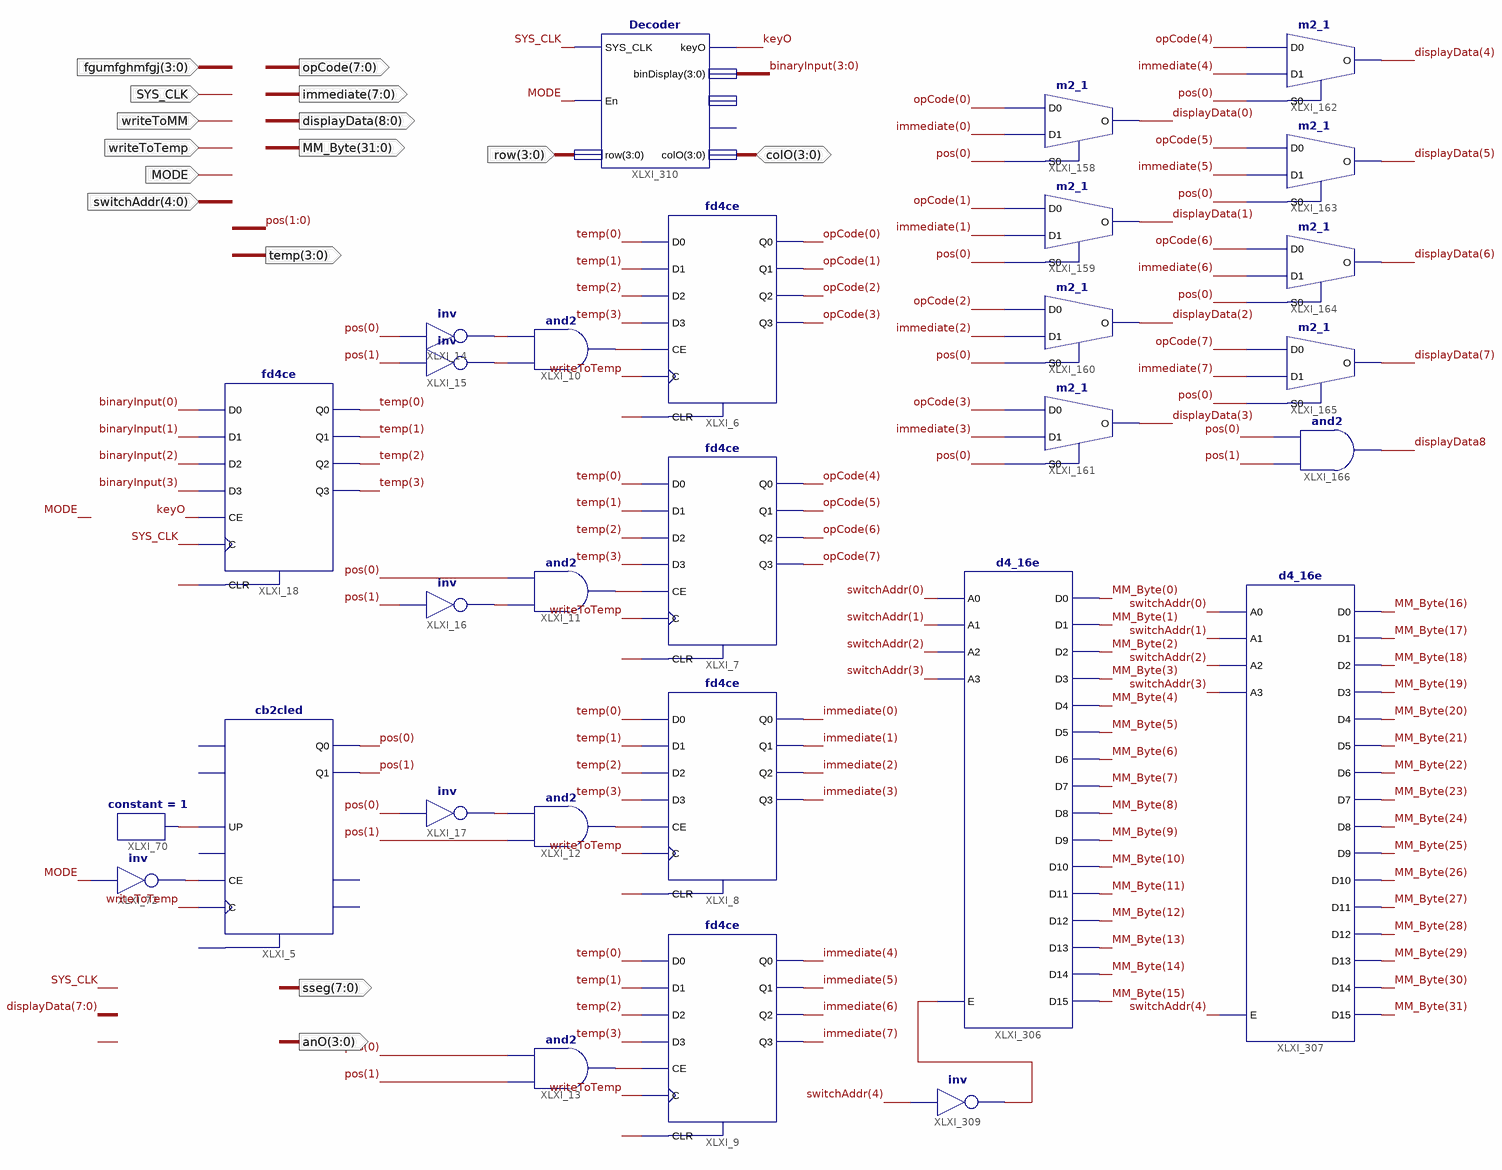
[diagram p0: schematic sheet 1]
// Xilinx ISE schematic inputProcessor.sch (spartan3e) as structural Verilog: 29 symbols, 15 ports
module inputProcessor (
  input  SYS_CLK,
  input  writeToTemp,
  input  [3:0] fgumfghmfgj,
  input  writeToMM,
  input  [4:0] switchAddr,
  input  MODE,
  input  [3:0] row,
  inout  [3:0] colO,
  output [7:0] opCode,
  output [7:0] immediate,
  output [8:0] displayData,
  output [31:0] MM_Byte,
  output [3:0] temp,
  output [7:0] sseg,
  output [3:0] anO
);

  wire displayData8, keyO, XLXN_3, XLXN_4, XLXN_5, XLXN_6, XLXN_7, XLXN_8, XLXN_9, XLXN_10, XLXN_77, XLXN_78,
       XLXN_79, XLXN_80, XLXN_87, XLXN_365, XLXN_368, XLXN_957;
  wire [1:0] pos;
  wire [3:0] binaryInput;

  fd4ce XLXI_18 (
    .C(SYS_CLK), .CE(keyO), .CLR(XLXN_87), .D0(binaryInput[0]), .D1(binaryInput[1]), .D2(binaryInput[2]),
    .D3(binaryInput[3]), .Q0(temp[0]), .Q1(temp[1]), .Q2(temp[2]), .Q3(temp[3]));
  fd4ce XLXI_6 (
    .C(writeToTemp), .CE(XLXN_3), .CLR(XLXN_80), .D0(temp[0]), .D1(temp[1]), .D2(temp[2]), .D3(temp[3]),
    .Q0(opCode[0]), .Q1(opCode[1]), .Q2(opCode[2]), .Q3(opCode[3]));
  fd4ce XLXI_7 (
    .C(writeToTemp), .CE(XLXN_4), .CLR(XLXN_79), .D0(temp[0]), .D1(temp[1]), .D2(temp[2]), .D3(temp[3]),
    .Q0(opCode[4]), .Q1(opCode[5]), .Q2(opCode[6]), .Q3(opCode[7]));
  fd4ce XLXI_8 (
    .C(writeToTemp), .CE(XLXN_5), .CLR(XLXN_77), .D0(temp[0]), .D1(temp[1]), .D2(temp[2]), .D3(temp[3]),
    .Q0(immediate[0]), .Q1(immediate[1]), .Q2(immediate[2]), .Q3(immediate[3]));
  fd4ce XLXI_9 (
    .C(writeToTemp), .CE(XLXN_6), .CLR(XLXN_78), .D0(temp[0]), .D1(temp[1]), .D2(temp[2]), .D3(temp[3]),
    .Q0(immediate[4]), .Q1(immediate[5]), .Q2(immediate[6]), .Q3(immediate[7]));
  not XLXI_15 (XLXN_7, pos[1]);
  not XLXI_14 (XLXN_10, pos[0]);
  and XLXI_10 (XLXN_3, XLXN_7, XLXN_10);
  not XLXI_16 (XLXN_8, pos[1]);
  and XLXI_11 (XLXN_4, XLXN_8, pos[0]);
  not XLXI_17 (XLXN_9, pos[0]);
  and XLXI_12 (XLXN_5, pos[1], XLXN_9);
  and XLXI_13 (XLXN_6, pos[1], pos[0]);
  cb2cled XLXI_5 (
    .C(writeToTemp), .CE(XLXN_368), .UP(XLXN_365), .Q0(pos[0]), .Q1(pos[1]));  // open: CLR, D0, D1, L, CEO, TC
  constant #(.CValue("1")) XLXI_70 (.O(XLXN_365));
  not XLXI_72 (XLXN_368, MODE);
  m2_1 XLXI_158 (.D0(opCode[0]), .D1(immediate[0]), .S0(pos[0]), .O(displayData[0]));
  m2_1 XLXI_159 (.D0(opCode[1]), .D1(immediate[1]), .S0(pos[0]), .O(displayData[1]));
  m2_1 XLXI_160 (.D0(opCode[2]), .D1(immediate[2]), .S0(pos[0]), .O(displayData[2]));
  m2_1 XLXI_161 (.D0(opCode[3]), .D1(immediate[3]), .S0(pos[0]), .O(displayData[3]));
  m2_1 XLXI_163 (.D0(opCode[5]), .D1(immediate[5]), .S0(pos[0]), .O(displayData[5]));
  m2_1 XLXI_164 (.D0(opCode[6]), .D1(immediate[6]), .S0(pos[0]), .O(displayData[6]));
  m2_1 XLXI_165 (.D0(opCode[7]), .D1(immediate[7]), .S0(pos[0]), .O(displayData[7]));
  m2_1 XLXI_162 (.D0(opCode[4]), .D1(immediate[4]), .S0(pos[0]), .O(displayData[4]));
  and XLXI_166 (displayData8, pos[1], pos[0]);
  d4_16e XLXI_307 (
    .A0(switchAddr[0]), .A1(switchAddr[1]), .A2(switchAddr[2]), .A3(switchAddr[3]), .E(switchAddr[4]),
    .D0(MM_Byte[16]), .D1(MM_Byte[17]), .D10(MM_Byte[26]), .D11(MM_Byte[27]), .D12(MM_Byte[28]),
    .D13(MM_Byte[29]), .D14(MM_Byte[30]), .D15(MM_Byte[31]), .D2(MM_Byte[18]), .D3(MM_Byte[19]),
    .D4(MM_Byte[20]), .D5(MM_Byte[21]), .D6(MM_Byte[22]), .D7(MM_Byte[23]), .D8(MM_Byte[24]), .D9(MM_Byte[25]));
  not XLXI_309 (XLXN_957, switchAddr[4]);
  d4_16e XLXI_306 (
    .A0(switchAddr[0]), .A1(switchAddr[1]), .A2(switchAddr[2]), .A3(switchAddr[3]), .E(XLXN_957),
    .D0(MM_Byte[0]), .D1(MM_Byte[1]), .D10(MM_Byte[10]), .D11(MM_Byte[11]), .D12(MM_Byte[12]),
    .D13(MM_Byte[13]), .D14(MM_Byte[14]), .D15(MM_Byte[15]), .D2(MM_Byte[2]), .D3(MM_Byte[3]),
    .D4(MM_Byte[4]), .D5(MM_Byte[5]), .D6(MM_Byte[6]), .D7(MM_Byte[7]), .D8(MM_Byte[8]), .D9(MM_Byte[9]));
  Decoder XLXI_310 (
    .SYS_CLK(SYS_CLK), .En(MODE), .row(row), .keyO(keyO), .binDisplay(binaryInput), .colO(colO));  // open: anO, dpO
endmodule
